# EAGLE schematic Circuit Schematic (EAGLE 9.6.2)
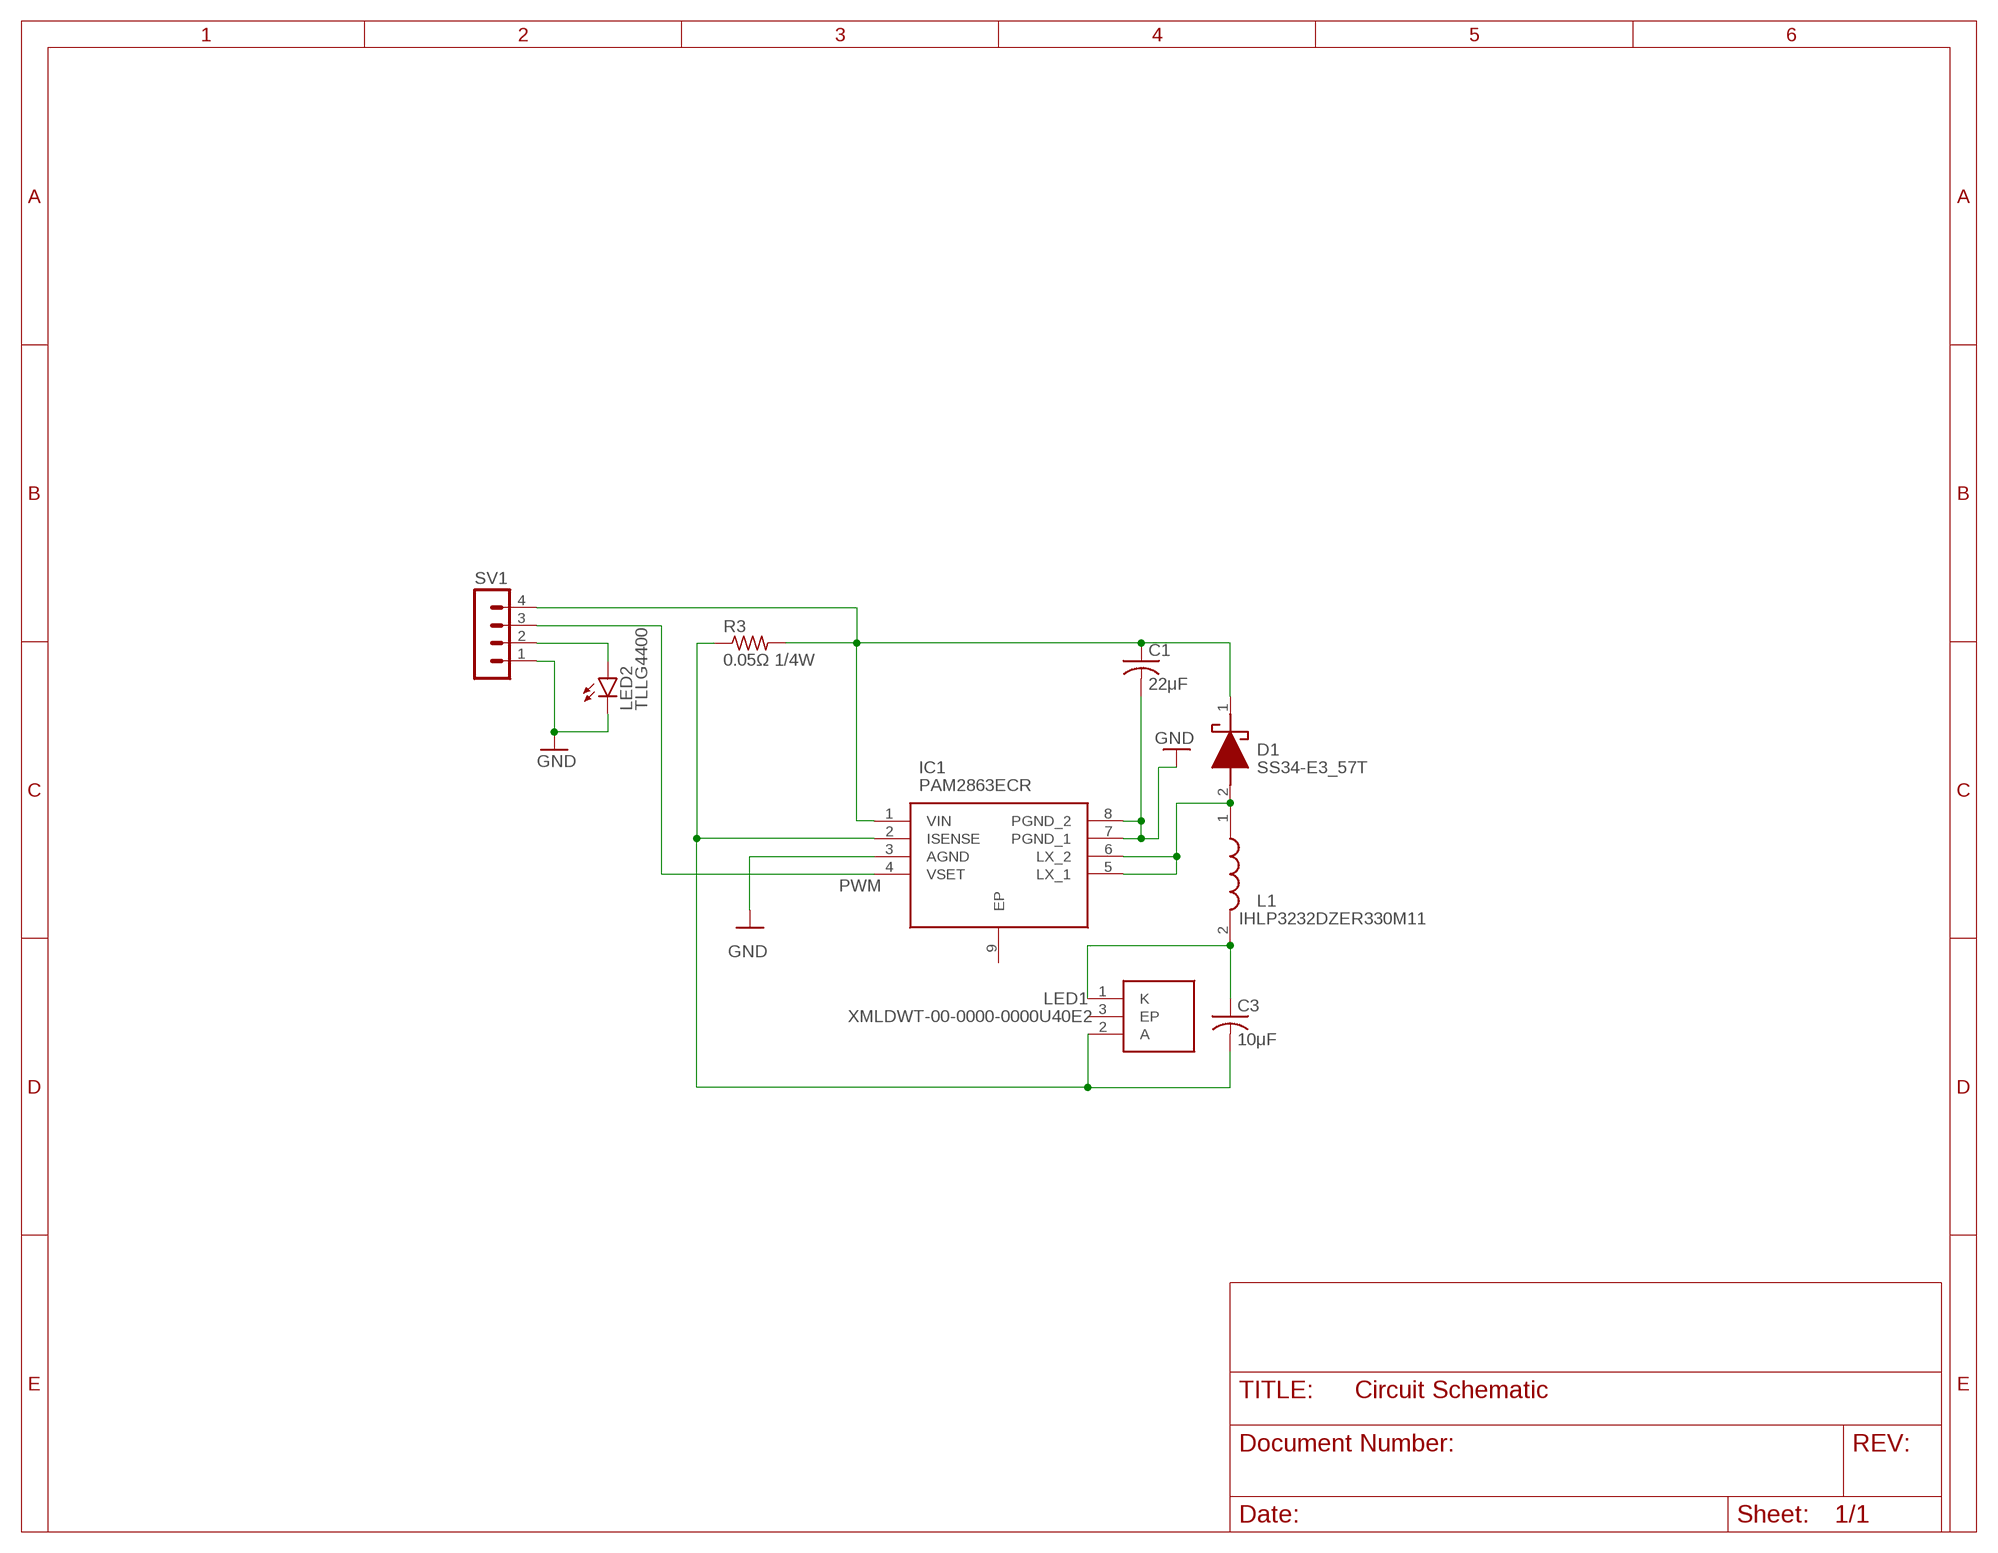
[diagram p0: schematic, sheet 1]

## Parts
C1  22μF  C-USC1210  [C1210]
C3  10μF  C-USC1210  [C1210]
D1  SS34-E3_57T  [DIOM7959X262N]
IC1  PAM2863ECR  [SOIC127P600X175-9N]
L1  IHLP3232DZER330M11  [IHLP3232DZER330M11]
LED1  XMLDWT-00-0000-0000U40E2  [XMLDWT0000000000U40E2]
LED2  TLLG4400  [LED3MM]
R3  0.05Ω 1/4W  R-US_R0805  [R0805]
SV1  MA04-1  [MA04-1]

## Nets
GND: C1.2 IC1.3(AGND) IC1.7(PGND_1) IC1.8(PGND_2) LED2.K(C) SV1.1
N$1: C3.1 L1.2 LED1.1(K)
N$2: LED2.A SV1.2
N$3: C3.2 IC1.2(ISENSE) LED1.2(A) R3.1
N$5: D1.2(A) IC1.5(LX_1) IC1.6(LX_2) L1.1
N$6: C1.1 D1.1(K) IC1.1(VIN) R3.2 SV1.4
PWM: IC1.4(VSET) SV1.3
Unconnected: IC1.9(EP) LED1.3(EP)

## Notes on the sheet
- PWM

## Library data of the parts
C1 C3 = rcl:C-US: CAPACITOR, American symbol; SPICEPREFIX: C
D1 = SS34-E3_57T:SS34-E3_57T: Vishay SS34-E3/57T SMT Schottky Diode, 40V 3A, 2-Pin DO-214AB Source: Datasheet <https://www.vishay.com/docs/88751/ss32.pdf>; DESCRIPTION: Vishay SS34-E3/57T SMT Schottky Diode, 40V 3A, 2-Pin DO-214AB; HEIGHT: 2.62mm; MANUFACTURER_NAME: Vishay; MANUFACTURER_PART_NUMBER: SS34-E3/57T; MOUSER_PART_NUMBER: 625-SS34-E3; MOUSER_PRICE-STOCK: https://www.mouser.co.uk/ProductDetail/Vishay-General-Semiconductor/SS34-E3-57T?qs=x2jpVgRnAtMC3f38kYWnRw%3D%3D
IC1 = PAM2863ECR:PAM2863ECR: Step-down LED Driver 1MHz 40V 2A SOP-8EP DiodesZetex PAM2863ECR LED Driver IC, 4.5 40 V dc 2A 8-Pin SOP Source: Datasheet <https://componentsearchengine.com/Datasheets/1/PAM2863ECR.pdf>; DESCRIPTION: Step-down LED Driver 1MHz 40V 2A SOP-8EP DiodesZetex PAM2863ECR LED Driver IC, 4.5 40 V dc 2A 8-Pin SOP; HEIGHT: 1.75mm; MANUFACTURER_NAME: Diodes Inc.; MANUFACTURER_PART_NUMBER: PAM2863ECR; MOUSER_PART_NUMBER: 621-PAM2863ECR; MOUSER_PRICE-STOCK: https://www.mouser.co.uk/ProductDetail/Diodes-Incorporated/PAM2863ECR?qs=pYVYkI7xuRXLW6Fe66wa3w%3D%3D
L1 = IHLP3232DZER330M11:IHLP3232DZER330M11: VISHAY - IHLP3232DZER330M11 - INDUCTOR, POWER, 33UH, 3.2A, 20% Source: Datasheet <http://www.vishay.com/docs/34313/ihlp3232dz11.pdf>; DESCRIPTION: VISHAY - IHLP3232DZER330M11 - INDUCTOR, POWER, 33UH, 3.2A, 20%; HEIGHT: 4mm; MANUFACTURER_NAME: Vishay; MANUFACTURER_PART_NUMBER: IHLP3232DZER330M11; MOUSER_PART_NUMBER: 70-IHLP3232DZER330M1; MOUSER_PRICE-STOCK: https://www.mouser.co.uk/ProductDetail/Vishay-Dale/IHLP3232DZER330M11?qs=Nbmv7C3%2FzlCWG7z%252BjqZ9qQ%3D%3D
LED1 = XMLDWT-00-0000-0000U40E2:XMLDWT-00-0000-0000U40E2: High Power LEDs - White White 5700K 340lm Source: Datasheet; DESCRIPTION: High Power LEDs - White White 5700K 340lm; HEIGHT: 3.02mm; MANUFACTURER_NAME: CREE LED; MANUFACTURER_PART_NUMBER: XMLDWT-00-0000-0000U40E2; MOUSER_PART_NUMBER: 941-XMLDWT0000U40E2; MOUSER_PRICE-STOCK: https://www.mouser.co.uk/ProductDetail/Cree-Inc/XMLDWT-00-0000-0000U40E2?qs=OlC7AqGiEDlKbRHig9Whrw%3D%3D
LED2 = led:TLLG4400: Low Current (2mA) LED 3 mm Tinted Diffused Package color GREEN Source: Data sheet <http://www.farnell.com/datasheets/391098.pdf>; MF: VISHAY SEMICONDUCTOR; OC_FARNELL: 1612435
R3 = rcl:R-US_: RESISTOR, American symbol; SPICEPREFIX: R
SV1 = con-lstb:MA04-1: PIN HEADER; OC_FARNELL: unknown; OC_NEWARK: unknown